# Altium schematic sheet main.schdoc
size 594 x 420 mm; Symbol: Drawing-Symbol_A4; Version: V1.0; Page Size: A4; Project: Bottle; @Update Date: 2026-04-30; @Create Date: 2026-03-28; Device: Drawing-Symbol_A4; @Board Name: main; @Page Name: P1; @Create Time: 23:23:22; @Page Count: 0; @Page No: 0; @Schematic Name: Schematic2; @Update Time: 23:23:22; @Assembly Variant: Basic; Border: 1; Title Block Position: 3; Size: A4; Width: 2338; Height: 1300; Region Start: 1; X Region Count: 6; Y Region Count: 4; Blade Width: 10; Title Block: 1; SheetNumber: 1; SheetTotal: 2
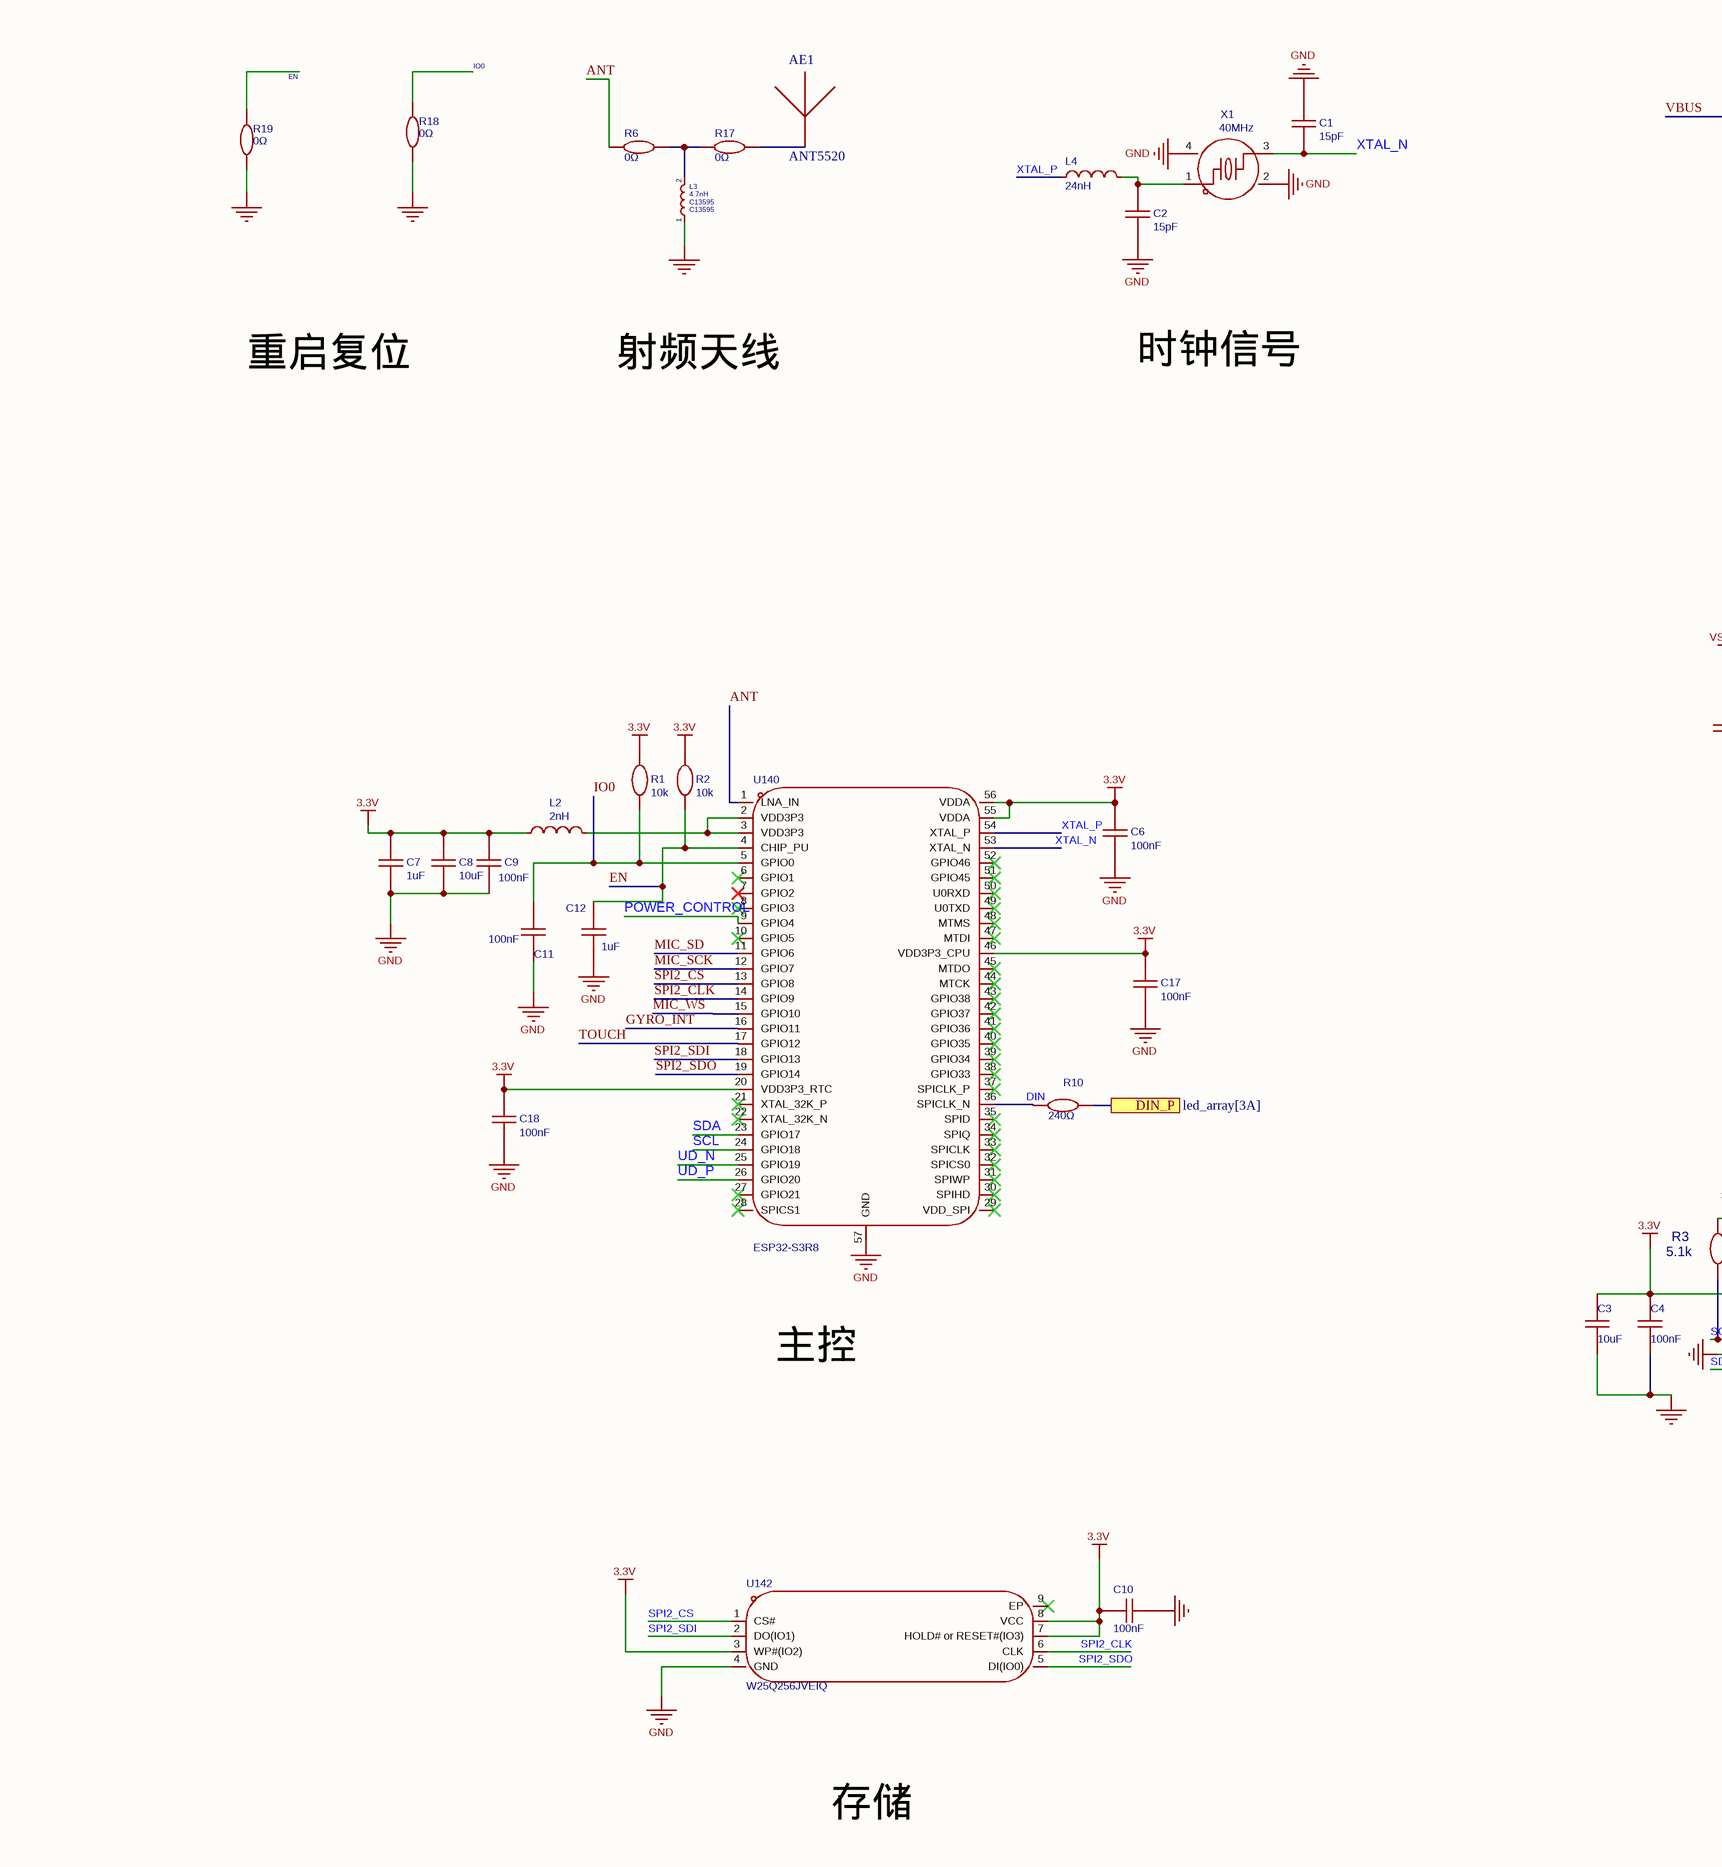
[diagram p0: main.schdoc, left]
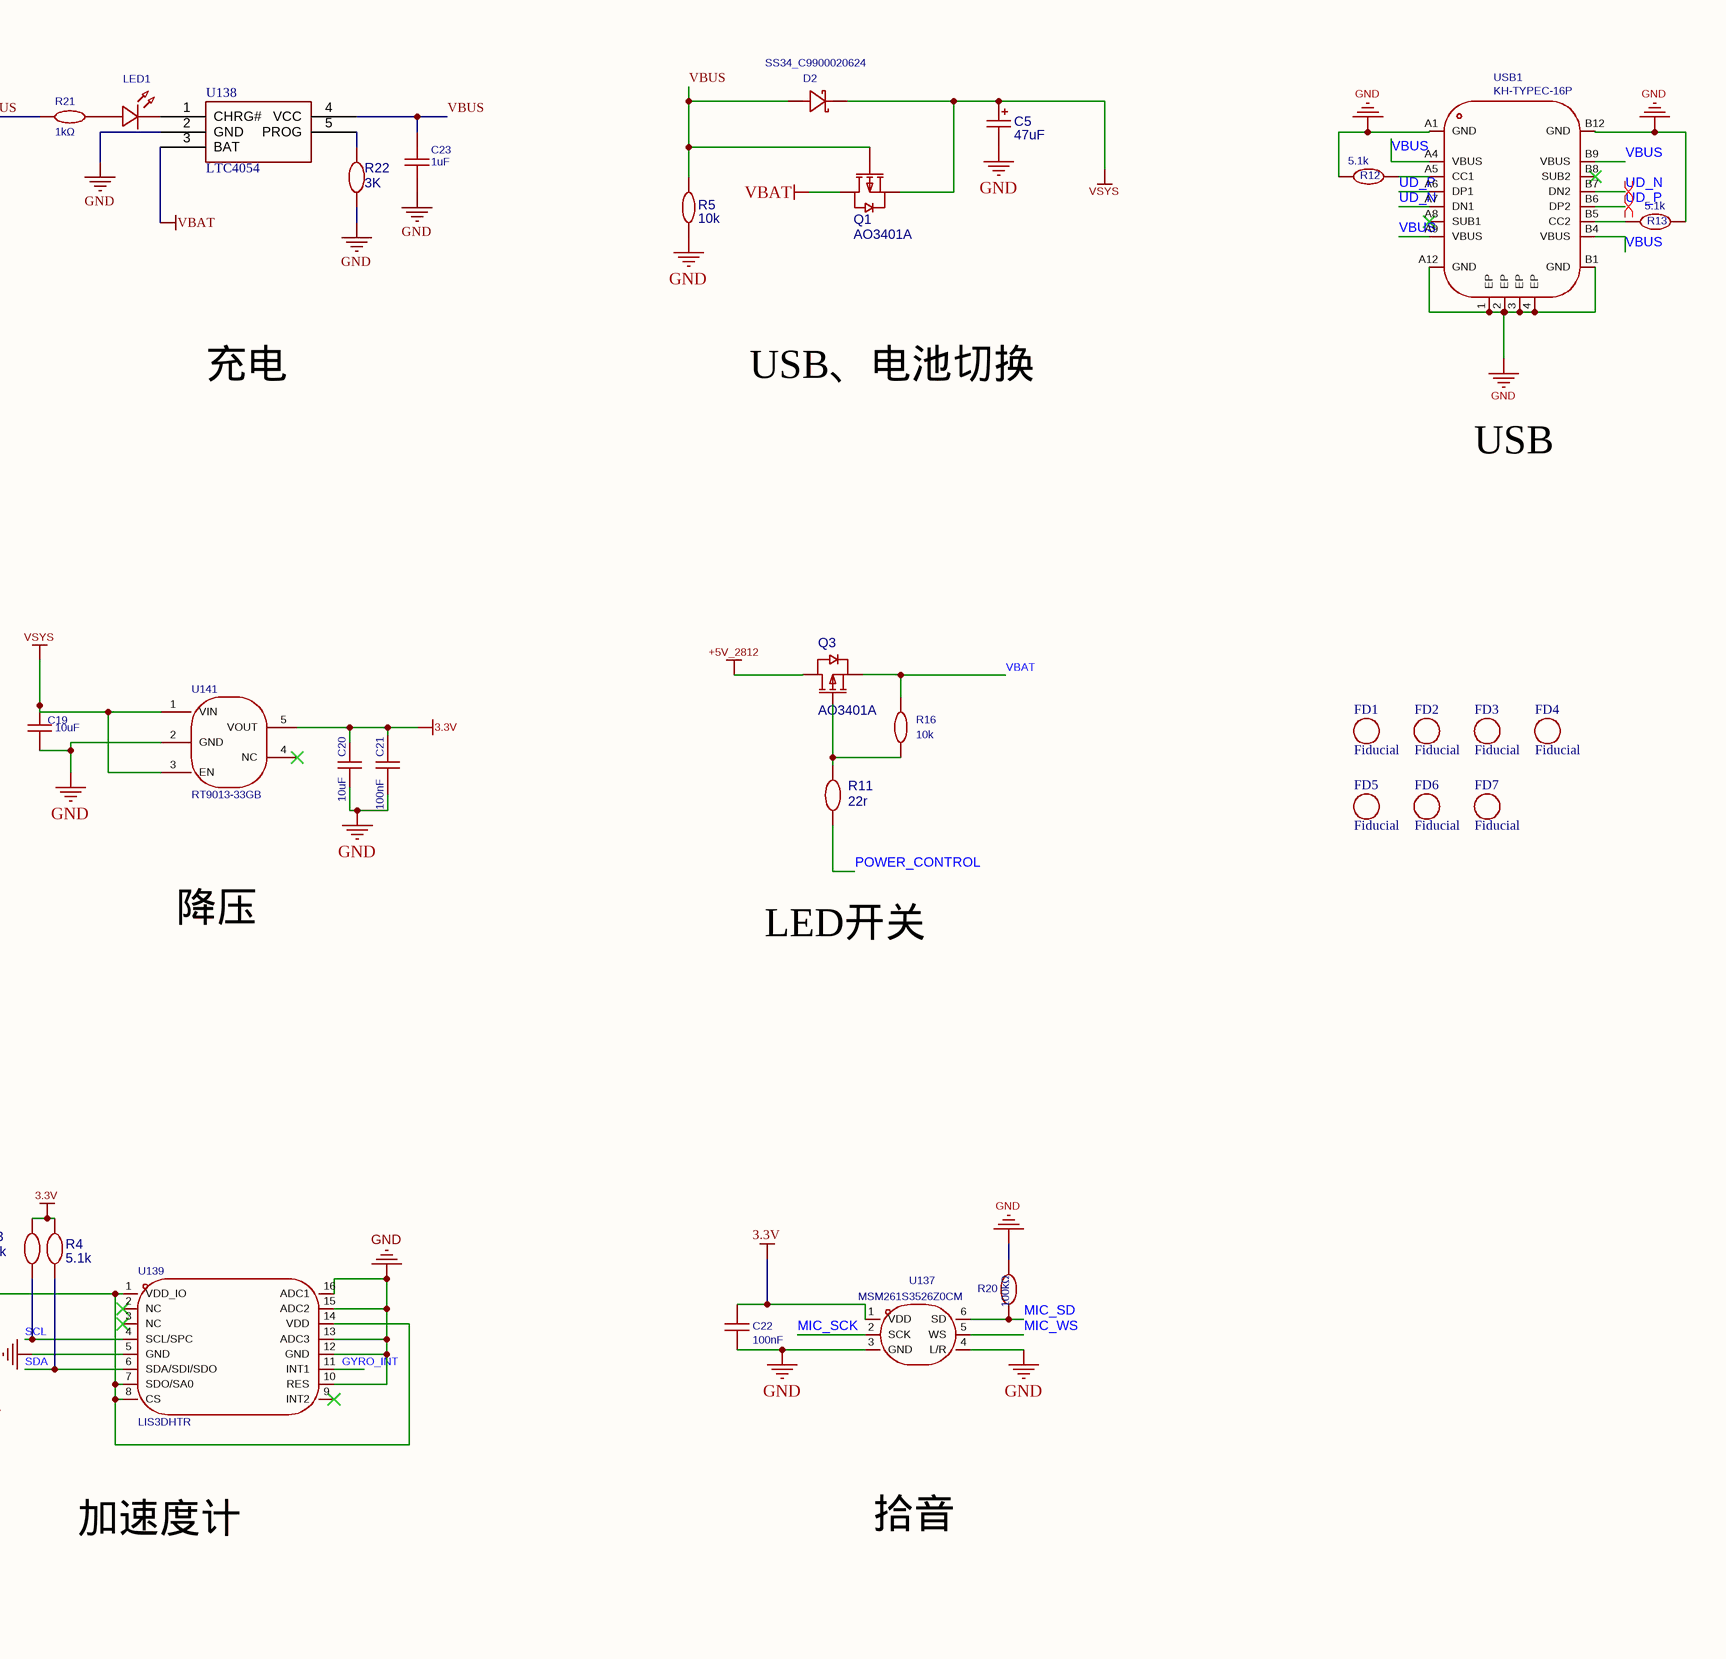
[diagram p1: main.schdoc, right]

## Parts
AE1  ANT5520  [ANT_5520]
C1  15pF  [C0402]
C2  15pF  [C0402]
C3  10uF  [C0402]
C4  100nF  [C0402]
C5  47uF  [C0603]
C6  100nF  [C0402]
C7  1uF  [C0402]
C8  10uF  [C0402]
C9  100nF  [C0402]
C10  100nF  [C0402]
C11  100nF  [C0402]
C12  1uF  [C0402]
C17  100nF  [C0402]
C18  100nF  [C0402]
C19  10uF  [C0402]
C20  10uF  [C0402]
C21  100nF  [C0402]
C22  100nF  [C0402]
C23  1uF  [C0402]
D2  SS34_C9900020624  [SMA_L4.3-W2.6-LS5.1-R-RD]
FD1  Fiducial  [FIDUCIAL_1MM]
FD2  Fiducial  [FIDUCIAL_1MM]
FD3  Fiducial  [FIDUCIAL_1MM]
FD4  Fiducial  [FIDUCIAL_1MM]
FD5  Fiducial  [FIDUCIAL_1MM]
FD6  Fiducial  [FIDUCIAL_1MM]
FD7  Fiducial  [FIDUCIAL_1MM]
L2  2nH  [C0402]
L3  value 4.7nH  MNF PART NUMBER: C13595  [C0402]  (hidden comment: 3nH)
L4  24nH  [C0402]
LED1  LED-0603_G  [C0402]  (value not drawn)
Q1  AO3401A  [SOT-23-3_L2.9-W1.6-P1.90-LS2.8-BR_1]
Q3  AO3401A  [SOT-23-3_L2.9-W1.3-P1.90-LS2.4-BR]
R1  10k  [R0402]
R2  10k  [R0402]
R3  5.1k  [R0402]
R4  5.1k  [R0402]
R5  10k  [R0402]
R6  value 0Ω  [R0402]  (hidden comment: 0r)
R10  value 240Ω  [R0402]  (hidden comment: 240r)
R11  22r  [R0402]
R12  5.1k  [R0402]
R13  5.1k  [R0402]
R16  10k  [R0402]
R17  value 0Ω  [R0402]  (hidden comment: 0r)
R18  value 0Ω  [R0402]  (hidden comment: 0r)
R19  value 0Ω  [R0402]  (hidden comment: 0r)
R20  100kΩ  [R0402]
R21  1kΩ  [R0402]
R22  3K  [R0402]
U137  MSM261S3526Z0CM  [MIC-SMD_6P-L3.5-W2.7-P0.90-TR]
U138  LTC4054  [SOT-23-5_L3.0-W1.7-P0.95-LS2.8-BL]
U139  LIS3DHTR  [LGA-16_L3.0-W3.0-P0.50-TL]
U140  ESP32-S3R8  [QFN-56_L7.0-W7.0-P0.40-TL-EP4.0]
U141  RT9013-33GB  [SOT-23-5_L3.0-W1.7-P0.95-LS2.8-BL]
U142  W25Q256JVEIQ  [WSON-8_L8.0-W6.10-P1.27-BL-EP-MINI]
USB1  KH-TYPEC-16P  [USB-TYPEC-16P-SMD]
X1  40MHz  [CRYSTAL-SMD_4P-L2.5-W2.0-BL]

## Ports
DIN_P (see led_array[3A])

## Nets
3.3V: C3.2 C4.2 C6.2 C7.2 C8.2 C9.2 C10.2 C17.2 C18.2 C20.2 C21.2 C22.2 L2.1 R1.2 R2.2 R3.2 R4.2 U137.1(VDD) U139.1(VDD_IO) U139.7(SDO/SA0) U139.8(CS) U139.14(VDD) U140.20(VDD3P3_RTC) U140.46(VDD3P3_CPU) U140.55(VDDA) U140.56(VDDA) U141.5(VOUT) U142.3(WP#(IO2)) U142.7(HOLD#_or_RESET#(IO3)) U142.8(VCC)
+5V_2812: Q3.3(D)
GND: C1.1 C2.2 C3.1 C4.1 C5.2 C6.1 C7.1 C8.1 C9.1 C10.1 C11.1 C12.1 C17.1 C18.1 C19.1 C20.1 C21.1 C22.1 C23.1 L3.1 R5.1 R12.1 R13.2 R18.1 R19.1 R20.2 R22.1 U137.3(GND) U137.4(L/R) U138.2(GND) U139.5(GND) U139.10(RES) U139.12(GND) U139.13(ADC3) U139.15(ADC2) U139.16(ADC1) U140.57(GND) U141.2(GND) U142.4(GND) USB1.1(EP) USB1.2(EP) USB1.3(EP) USB1.4(EP) USB1.A1(GND) USB1.A12(GND) USB1.B1(GND) USB1.B12(GND) X1.2(GND) X1.4(GND)
VBAT: Q1.3(D) Q3.2(S) R16.1 U138.3(BAT)
VSYS: C5.1 C19.2 D2.2(K) Q1.2(S) U141.1(VIN) U141.3(EN)
ANT: R6.1 U140.1(LNA_IN)
DIN: R10.1 U140.36(SPICLK_N)
DIN_P: R10.2 ; port DIN_P
EN: C12.2 R2.1 R19.2 U140.4(CHIP_PU)
GYRO_INT: U139.11(INT1) U140.16(GPIO11)
IO0: C11.2 R1.1 R18.2 U140.5(GPIO0)
MIC_SCK: U137.2(SCK) U140.12(GPIO7)
MIC_SD: R20.1 U137.6(SD) U140.11(GPIO6)
MIC_WS: U137.5(WS) U140.15(GPIO10)
POWER_CONTROL: R11.2 U140.9(GPIO4)
SCL: R3.1 U139.4(SCL/SPC) U140.24(GPIO18)
SDA: R4.1 U139.6(SDA/SDI/SDO) U140.23(GPIO17)
SPI2_CLK: U140.14(GPIO9) U142.6(CLK)
SPI2_CS: U140.13(GPIO8) U142.1(CS#)
SPI2_SDI: U140.18(GPIO13) U142.2(DO(IO1))
SPI2_SDO: U140.19(GPIO14) U142.5(DI(IO0))
TOUCH: U140.17(GPIO12)
UD_N: U140.25(GPIO19) USB1.A7(DN1) USB1.B7(DN2)
UD_P: U140.26(GPIO20) USB1.A6(DP1) USB1.B6(DP2)
VBUS: C23.2 D2.1(A) Q1.1(G) R5.2 R21.2 U138.4(VCC) USB1.A4(VBUS) USB1.A9(VBUS) USB1.B4(VBUS) USB1.B9(VBUS)
XTAL_N: C1.2 U140.53(XTAL_N) X1.3
XTAL_P: L4.1 U140.54(XTAL_P)
NetAE1_1: AE1.1(ANT) R17.2
NetC2_1: C2.1 L4.2 X1.1
NetL2_2: L2.2 U140.2(VDD3P3) U140.3(VDD3P3)
NetL3_2: L3.2 R6.2 R17.1
NetLED1_1: LED1.1 R21.1
NetLED1_2: LED1.2 U138.1(CHRG#)
NetQ3_1: Q3.1(G) R11.1 R16.2
NetR12_2: R12.2 USB1.A5(CC1)
NetR13_1: R13.1 USB1.B5(CC2)
NetR22_2: R22.2 U138.5(PROG)

Not connected (* = marked no-connect by the designer): AE1 2; U139 2(NC)* 3(NC)* 9(INT2)*; U140 6(GPIO1)* 7(GPIO2)* 8(GPIO3)* 10(GPIO5)* 21(XTAL_32K_P)* 22(XTAL_32K_N)* 27(GPIO21)* 28(SPICS1)* 29(VDD_SPI)* 30(SPIHD)* 31(SPIWP)* 32(SPICS0)* 33(SPICLK)* 34(SPIQ)* 35(SPID)* 37(SPICLK_P)* 38(GPIO33)* 39(GPIO34)* 40(GPIO35)* 41(GPIO36)* 42(GPIO37)* 43(GPIO38)* 44(MTCK)* 45(MTDO)* 47(MTDI)* 48(MTMS)* 49(U0TXD)* 50(U0RXD)* 51(GPIO45)* 52(GPIO46)*; U141 4(NC)*; U142 9(EP)*; USB1 A8(SUB1)* B8(SUB2)*

## Layout directives
differential pair: UD_N, UD_P

## Notes on the sheet
- 重启复位
- 射频天线
- 时钟信号
- 充电
- USB、电池切换
- USB
- 降压
- LED开关
- 主控
- 加速度计
- 拾音
- 存储
- DWG NO:
- REV:
- THIS DOCUMENT AND THE DATA DISCLOSED HEREIN OR
- HEREWITH IS THE PROPERTY OF ALTIUM LIMITED AND MAY
- BE FREELY DISTRIBUTED IN WHOLE. NO RIGHTS ARE
- RESERVED OR EXPRESS OR IMPLIED WARANTEE GIVEN.
- REVISION
- DESCRIPTION
- DATE
- APPROVED
- ENG:
- APPROVALS
- PROJECT
- DSN:
- CHK:
- REFERENCE DOCUMENTS
- PROJECT REVISION:
- TITLE
- DOCUMENT REVISION:
- DESIGN ITEM:
- BOM:
- FAB DWG:
- PCB DWG:
- ASSY DWG:
- SCALE:
- A2
- SIZE
- CAGE CODE
- FILE NAME
- DWG NO.
- SHEET
- OF
- REV

## Library data of the parts
AE1 = ANT_5520
C1 C2 = 10PF: Add into BOM: yes; ModelId: fca5be93b99f4b5a9a2fd372d58c31d9; ModelName: C0603; Symbol: 10PF; Device: 10PF; Convert to PCB: yes; FootprintName: C0603
  C1: Origin Footprint: C0603
C3 C4 C10 = CGA0603X7R104K500JT: 容值:100nF;精度:±10%;额定电压:50V;材质(温度系数):X7R;; Manufacturer: HRE(芯声); AddInBom: yes; ModelId: ac125912035d415993ca9572d50418b1; ModelName: C0603_L1.6-W0.8-H0.8; ModelTransform: 62.992,31.496,0,0,0,0,0,0,0; Tolerance: ±10%; Voltage Rated: 50V; Temperature Coefficient: X7R; Symbol: CGA0603X7R104K500JT; Device: CGA0603X7R104K500JT; LCSC Part Name: 100nF ±10% 50V; ManufacturerPart: CGA0603X7R104K500JT; Supplier Footprint: 0603; Supplier: LCSC; ConvertToPcb: yes; FootprintName: C0603
  C3: Value: 10uF
  C4 C10: SupplierPart: C6119867; Value: 100nF
C5 = CA45-B-10V-47uF-K: 容值:47uF;精度:±10%;额定电压:10V;等效串联电阻:2.4Ω@100kHz;; Manufacturer: CEC(振华新云); Add into BOM: yes; Origin Footprint: CAP-SMD_L3.5-W2.8-R-RD; 3D Model: b77bd53aeda446d2bdd09b0fdaf9418a; 3D Model Transform: 145.669,110.236,0,0,0,0,0,0,0; Tolerance: ±10%; Rated Voltage: 10V; ModelName: CASE-B_L3.5-W2.8-H1.9; Symbol: 47uF; Device: CA45-B-10V-47uF-K; Convert to PCB: yes; LCSC Part Name: 47uF ±10% 10V; Supplier Part: C136658; Manufacturer Part: CA45-B-10V-47uF-K; Supplier Footprint: CASE-B-3528; JLCPCB Part Class: Extended Part; Datasheet: https://atta.szlcsc.com/upload/public/pdf/source/20171123/C136658_15114108124621137439.pdf; Supplier: LCSC; Value: 47uF; Equivalent Series Resistance(ESR): 2.4Ω@100kHz; Operating Temperature: -55℃~+125℃; FootprintName: CASE-B_3528
C6 C9 C17 C18 = 100NF: Add into BOM: yes; Origin Footprint: C0603; ModelId: fca5be93b99f4b5a9a2fd372d58c31d9; Symbol: 100NF; Device: 100NF; Convert to PCB: yes; FootprintName: C0603; ModelName: C0603
C7 C11 C12 = 1UF: Add into BOM: yes; Origin Footprint: C0603; ModelId: fca5be93b99f4b5a9a2fd372d58c31d9; Symbol: 1UF; Device: 1UF; Convert to PCB: yes; FootprintName: C0603; ModelName: C0603
C8 = 10UF: Add into BOM: yes; Origin Footprint: C0603; ModelId: fca5be93b99f4b5a9a2fd372d58c31d9; Symbol: 10UF; Device: 10UF; Convert to PCB: yes; FootprintName: C0603; ModelName: C0603
C19 C20 = CL21A106KAYNNNE_C15850: 容值:10uF;精度:±10%;额定电压:25V;材质(温度系数):X5R;; Manufacturer: SAMSUNG(三星); 3D Model: 1ba041120af144c991958decab20d241; 3D Model Transform: 78.74,51.181,0,0,0,0,0,0.0005,0; Tolerance: ±10%; Voltage Rated: 25V; Temperature Coefficient: X5R; AddInBom: yes; ModelName: C0805_L2.0-W1.3-H1.3; Symbol: CL21A106KAYNNNE; Device: CL21A106KAYNNNE_C15850; LCSC Part Name: 10uF ±10% 25V; Manufacturer Part: CL21A106KAYNNNE; Supplier Footprint: 0805; JLCPCB Part Class: 基础库; Datasheet: https://atta.szlcsc.com/upload/public/pdf/source/20160103/1457707679302.pdf; Supplier: LCSC; Value: 10UF; ConvertToPcb: yes; FootprintName: C0805
C21 = CC0603KRX7R9BB104: 容值:100nF;精度:±10%;额定电压:50V;材质(温度系数):X7R;; Manufacturer: YAGEO(国巨); 3D Model: ac125912035d415993ca9572d50418b1; 3D Model Transform: 62.992,31.496,0,0,0,0,0,0,0; Tolerance: ±10%; Voltage Rated: 50V; Temperature Coefficient: X7R; AddInBom: yes; ModelName: C0603_L1.6-W0.8-H0.8; Symbol: CC0603KRX7R9BB104; Device: CC0603KRX7R9BB104; LCSC Part Name: 100nF ±10% 50V; Manufacturer Part: CC0603KRX7R9BB104; Supplier Footprint: 0603; JLCPCB Part Class: 基础库; Datasheet: https://atta.szlcsc.com/upload/public/pdf/source/20180910/C282072_33301C7F631E79921B82A8DAC6BCC5B3.pdf; Supplier: LCSC; Value: 100NF; ConvertToPcb: yes; FootprintName: C0603
C22 = CL05B104KO5NNNC: 容值:100nF;精度:±10%;额定电压:16V;温度系数:X7R;; Manufacturer: SAMSUNG(三星); Symbol: 0.1uF; Add into BOM: yes; Voltage Rating: 16V; 3D Model: 36a51122f27c49738f86b3bfa98863e0; 3D Model Transform: 39.37,19.685,0,0,0,0,0,0,0; Tolerance: ±10%; Temperature Coefficient: X7R; ModelName: C0402_L1.0-W0.5-H0.5; Device: CL05B104KO5NNNC; Convert to PCB: yes; Supplier: LCSC; Manufacturer Part: CL05B104KO5NNNC; Supplier Part: C1525; JLCPCB Part Class: Basic Part; Datasheet: https://atta.szlcsc.com/upload/public/pdf/source/20160218/1457707763339.pdf; LCSC Part Name: 100nF ±10% 16V; Supplier Footprint: 0402; Value: 100nF; Voltage Rated: 16V; FootprintName: C0402_1
C23 = 1uF: Add into BOM: yes; Origin Footprint: C0603; ModelId: fca5be93b99f4b5a9a2fd372d58c31d9; Symbol: 1UF; Device: 1UF; Convert to PCB: yes; FootprintName: C0603; ModelName: C0603
D2 = SS34_C9900020624: Manufacturer: null; Add into BOM: yes; ModelId: 6890bb9641474820a71fce2135ca3aaa; Symbol: SS34_C9900020624; Device: SS34_C9900020624; Convert to PCB: yes; Origin Footprint: SMA_L4.3-W2.6-LS5.1-R-RD; Supplier: LCSC; Supplier Part: C9900020624; JLCPCB Part Class: Extended Part; FootprintName: SMA_L4.3-W2.6-LS5.1-R-RD; ModelName: SMA_L4.3-W2.6-LS5.1-R-RD
L2 = 2nH: Add into BOM: yes; Origin Footprint: L0603; Symbol: 2nH; Device: 2nH; Convert to PCB: yes; FootprintName: L0603
L3 = Device_L: Inductor; ki_keywords: inductor choke coil reactor magnetic; ki_fp_filters: Choke_* *Coil* Inductor_* L_*; UniqueId: 01f5988480b85854; Attribute1: L6; AddInBom: yes; Device: Device_L; Symbol: Device_L; UserDocLink: ~; LCSC: C13595; FootprintName: Inductor_SMD:L_0402_1005Metric
L4 = 24nH: Add into BOM: yes; Origin Footprint: L0603; Symbol: 24nH; Device: 24nH; Convert to PCB: yes; FootprintName: L0603
LED1 = LED-0603_G: Manufacturer: EVERLIGHT(台湾亿光); Manufacturer Part: 19-217/GHC-YR1S2/3T; Add into BOM: yes; Origin Footprint: LED0603_GREEN; ModelId: 8b5fcaf0229049f8a37a9c352bb0ca0a; Symbol: LED-0603_G; Device: LED-0603_G; Convert to PCB: yes; Supplier Part: C72043; Supplier: LCSC; FootprintName: LED0603_GREEN; ModelName: LED-0603_G
Q1 = CJ3401_1: 类型:P沟道;漏源电压(Vdss):30V;连续漏极电流(Id):4.2A;功率(Pd):350mW;导通电阻(RDS(on)@Vgs,Id):65mΩ@10V,4.2A;; Manufacturer: CJ(江苏长电/长晶); Symbol: CJ3401; Add into BOM: yes; Origin Footprint: SOT-23-3_L2.9-W1.6-P1.90-LS2.8-BR; 3D Model: 89cb27a44ab2466697082bb9fd73a7d0; 3D Model Transform: 110.236,114.173,0,180,0,0,-0.005,0.0005,0; Type: P沟道; Drain Source Voltage (Vdss): 30V; Power Dissipation (Pd): 350mW; Gate Threshold Voltage (Vgs(th)@Id): 1.3V@250uA; ModelName: SOT-23-3L_L2.9-W1.6-H1.1-LS2.8-P0.95; Device: CJ3401_1; Convert to PCB: yes; LCSC Part Name: P沟道 30V 4.2A; Supplier Part: C13799; Manufacturer Part: CJ3401; Supplier Footprint: SOT-23; JLCPCB Part Class: Extended Part; Datasheet: https://atta.szlcsc.com/upload/public/pdf/source/20140815/1457707217656.pdf; Supplier: LCSC; Continuous Drain Current (Id): 4.2A; Drain Source On Resistance (RDS(on)@Vgs,Id): 65mΩ@10V,4.2A; FootprintName: SOT-23-3_L2.9-W1.6-P1.90-LS2.8-BR_1
Q3 = SI2301CDS: Manufacturer: TECH PUBLIC(台舟); Add into BOM: yes; 3D Model: d777607a152f4f3aac9bb0d0c14ed6fd; 3D Model Transform: v2:[-39.37007874015748,4.821444091131312e-15,0,-4.821444091131312e-15,-39.37007874015748,0,0,0,39.37007874015748,0.001,-0.001,0]; ModelName: SOT-23-3P_L2.9-W1.3-H1.0-LS2.4-P0.95; Symbol: SI2301CDS; Device: SI2301CDS; Convert to PCB: yes; Supplier: LCSC; Supplier Part: C2841446; Manufacturer Part: SI2301CDS; JLCPCB Part Class: Extended Part; FootprintName: SOT-23-3_L2.9-W1.3-P1.90-LS2.4-BR
R1 R2 = 10k: Add into BOM: yes; Origin Footprint: R0603; ModelId: fc143cca1e79419f9cd78b61e9279f08; Symbol: 10k; Device: 10k; Convert to PCB: yes; FootprintName: R0603; ModelName: R0603
R3 R4 R22 = 4.7K: Add into BOM: yes; 3D Model: 6bd5cd867e9542ebae21caaf5d2d4c4d; 3D Model Transform: v2:[2.410722045565656e-15,39.37007874015748,0,-39.37007874015748,2.410722045565656e-15,0,0,0,39.37007874015748,0,0,0]; ModelName: R0603; Symbol: 4.7K; Device: 4.7K; Convert to PCB: yes; FootprintName: R0603
R5 = AC0805FR-0710KL: 电阻类型:厚膜电阻;阻值:10kΩ;精度:±1%;功率:125mW;; Manufacturer: YAGEO(国巨); Symbol: 10K_1; Add into BOM: yes; Origin Footprint: R0805; Resistance: 10kΩ; 3D Model: 37a81e68749a4138bd2dfa6897b24b85; 3D Model Transform: 78.74,51.181,0,0,0,0,0,-0.0005,0; Value: 10kΩ; Tolerance: ±1%; Power(Watts): 125mW; Temperature Coefficient: ±100ppm/℃; Overload Voltage (Max): 150V; ModelName: R0805_L2.0-W1.3-H0.6; Device: AC0805FR-0710KL; Convert to PCB: yes; LCSC Part Name: 10kΩ ±1% 125mW; Supplier Part: C140868; Manufacturer Part: AC0805FR-0710KL; Supplier Footprint: 0805; JLCPCB Part Class: Extended Part; Datasheet: https://atta.szlcsc.com/upload/public/pdf/source/20171113/C140868_15105613027091115785.pdf; Supplier: LCSC; Type: 厚膜电阻; Operating Temperature Range: -55℃~+155℃; FootprintName: R0603
R6 R17-R19 = 0402WGF0000TCE: 阻值:0Ω;精度:±1%;功率:62.5mW;温度系数:±800ppm/℃;电阻类型:厚膜电阻;; Manufacturer: UNI-ROYAL(厚声); AddInBom: yes; ModelId: 671aefced39d4c318694bba8bd8efd39; ModelName: R0402_L1.0-W0.5-H0.5; ModelTransform: 39.37,19.685,0,0,0,0,0,0.0005,0; Tolerance: ±1%; Power(Watts): 62.5mW; Overload Voltage (Max): 50V; JLCPCB Part Class: Basic Part; Symbol: 0402WGF0000TCE; Device: 0402WGF0000TCE; Supplier: LCSC; Manufacturer Part: 0402WGF0000TCE; Supplier Part: C17168; LCSC Part Name: 0Ω ±1% 62.5mW 厚膜电阻; Supplier Footprint: 0402; Datasheet: https://atta.szlcsc.com/upload/public/pdf/source/20200306/C422600_1E6D84923E4A46A82E41ADD87F860B5C.pdf; ConvertToPcb: yes; FootprintName: R0402; Temperature Coefficient: ±800ppm/℃; Type: 厚膜电阻; Operating Temperature Range: -55℃~+155℃
R10 = 0402WGF2400TCE: 阻值:240Ω;精度:±1%;功率:62.5mW;温度系数:±100ppm/℃;电阻类型:厚膜电阻;; Manufacturer: UNI-ROYAL(厚声); AddInBom: yes; ModelId: 671aefced39d4c318694bba8bd8efd39; ModelName: R0402_L1.0-W0.5-H0.5; ModelTransform: 39.37,19.685,0,0,0,0,0,0.0005,0; Tolerance: ±1%; Power(Watts): 62.5mW; Overload Voltage (Max): 50V; JLCPCB Part Class: Extended Part; Symbol: 0402WGF2400TCE; Device: 0402WGF2400TCE; Supplier: LCSC; Manufacturer Part: 0402WGF2400TCE; Supplier Part: C25094; LCSC Part Name: 240Ω ±1% 62.5mW 厚膜电阻; Supplier Footprint: 0402; Datasheet: https://atta.szlcsc.com/upload/public/pdf/source/20200306/C422600_1E6D84923E4A46A82E41ADD87F860B5C.pdf; ConvertToPcb: yes; FootprintName: R0402; Temperature Coefficient: ±100ppm/℃; Type: 厚膜电阻; Operating Temperature Range: -55℃~+155℃
R11 = 22r: Add into BOM: yes; 3D Model: 6bd5cd867e9542ebae21caaf5d2d4c4d; 3D Model Transform: v2:[2.410722045565656e-15,39.37007874015748,0,-39.37007874015748,2.410722045565656e-15,0,0,0,39.37007874015748,0,0,0]; ModelName: R0603; Symbol: 22r; Device: 22r; Convert to PCB: yes; FootprintName: R0603
R12 R13 = 5.1k: Add into BOM: yes; Origin Footprint: R0603; ModelId: fc143cca1e79419f9cd78b61e9279f08; Symbol: 5.1k; Device: 5.1k; Convert to PCB: yes; FootprintName: R0603; ModelName: R0603
R16 = 0603WAF1002T5E: 电阻类型:厚膜电阻;阻值:10kΩ;精度:±1%;功率:100mW;工作电压:75V;温度系数:±100ppm/℃;; Manufacturer: UNI-ROYAL(厚声); Add into BOM: yes; 3D Model: fc143cca1e79419f9cd78b61e9279f08; 3D Model Transform: 31.8897,63.7794,0,90,0,0,0,0,0; Value: 10kΩ; Tolerance: ±1%; Power(Watts): 100mW; Voltage-Supply(Max): 75V; ModelName: R0603; Symbol: 0603WAF1002T5E; Device: 0603WAF1002T5E; Convert to PCB: yes; Supplier Part: C25804; Supplier: LCSC; Manufacturer Part: 0603WAF1002T5E; LCSC Part Name: 厚膜电阻 10kΩ ±1% 100mW; Supplier Footprint: 0603; JLCPCB Part Class: Basic Part; Datasheet: https://item.szlcsc.com/datasheet/0603WAF1002T5E/26547.html; Type: 厚膜电阻; Temperature Coefficient: ±100ppm/℃; Operating Temperature: -55℃~+155℃; FootprintName: R0603
R20 = 0402WGF1003TCE: 电阻类型:厚膜电阻;阻值:100kΩ;精度:±1%;功率:62.5mW;工作电压:50V;温度系数:±100ppm/℃;; Manufacturer: UNI-ROYAL(厚声); Symbol: 100k; Add into BOM: yes; 3D Model: 671aefced39d4c318694bba8bd8efd39; 3D Model Transform: 39.37,19.685,0,0,0,0,0,0.0005,0; Voltage-Supply(Max): 50V; Tolerance: ±1%; Power(Watts): 62.5mW; ModelName: R0402_L1.0-W0.5-H0.5; Device: 0402WGF1003TCE; Convert to PCB: yes; Supplier Part: C25741; Supplier: LCSC; Manufacturer Part: 0402WGF1003TCE; LCSC Part Name: 100kΩ ±1% 62.5mW; JLCPCB Part Class: 基础库; Datasheet: https://atta.szlcsc.com/upload/public/pdf/source/20200306/C422600_1E6D84923E4A46A82E41ADD87F860B5C.pdf; Operating Temperature: -55℃~+155℃; Supplier Footprint: 0402; Type: 厚膜电阻; Value: 100kΩ; Temperature Coefficient: ±100ppm/℃; Overload Voltage (Max): 50V; Operating Temperature Range: -55℃~+155℃; FootprintName: R0402_1
R21 = 0603WAF1001T5E: 电阻类型:厚膜电阻;阻值:1kΩ;精度:±1%;功率:100mW;工作电压:75V;温度系数:±100ppm/℃;; Manufacturer: UNI-ROYAL(厚声); Add into BOM: yes; 3D Model: fc143cca1e79419f9cd78b61e9279f08; 3D Model Transform: 31.8897,63.7794,0,90,0,0,0,0,0; Tolerance: ±1%; Power(Watts): 100mW; Voltage-Supply(Max): 75V; ModelName: R0603; Symbol: 0603WAF1001T5E; Device: 0603WAF1001T5E; Convert to PCB: yes; Supplier Part: C21190; Supplier: LCSC; Manufacturer Part: 0603WAF1001T5E; LCSC Part Name: 1kΩ ±1% 100mW 厚膜电阻; Supplier Footprint: 0603; JLCPCB Part Class: Basic Part; Datasheet: https://item.szlcsc.com/datasheet/0603WAF1001T5E/21904.html; Type: 厚膜电阻; Value: 1kΩ; Temperature Coefficient: ±100ppm/℃; Operating Temperature: -55℃~+155℃; FootprintName: R0603
U137 = MSM261S3526Z0CM: 方向:全指向;信噪比:64dB;灵敏度:-26dB;阻抗:-;; Manufacturer: MEMS(敏芯微); Symbol: MSM261S3526Z0CM_1; Add into BOM: yes; 3D Model: 76b3790cc1704d2883f926567aae47b1; 3D Model Transform: 106.299,137.795,0,0,0,0,0,0,0; Direction: 全指向; Supply Voltage: 1.8V; Current Consumption: 750uA; SNR(Signal to Noise Ratio): 64dB; Sensitivity: -26dB; Device: MSM261S3526Z0CM; Convert to PCB: yes; Supplier: LCSC; Supplier Part: C966933; Manufacturer Part: MSM261S3526Z0CM; JLCPCB Part Class: Extended Part; LCSC Part Name: MSM261S3526Z0CM; Supplier Footprint: LGA-6(2.7x3.5); Datasheet: https://atta.szlcsc.com/upload/public/pdf/source/20210104/C966933_3269232C81BB891E12095FC7E88FC637.pdf; Impedance: -; FootprintName: MIC-SMD_6P-L3.5-W2.7-P0.90-TR; ModelName: MIC-SMD_6P-L3.5-W2.7-P0.90-TR
U139 = LIS3DHTR: 轴向:X,Y,Z;; Manufacturer: ST(意法半导体); Symbol: LIS3DHTR_C15134; AddInBom: yes; ModelId: 9ae441d1842848bda5fda48efd45bd94; ModelTransform: 118.11,118.11,0,0,0,0,0,0,0; Axial Direction: X,Y,Z; Supply Voltage: 1.71V~3.6V; Device: LIS3DHTR; LCSC Part Name: LIS3DHTR; SupplierPart: C15134; ManufacturerPart: LIS3DHTR; Supplier Footprint: LGA-16(3x3); JLCPCB Part Class: 扩展库; Datasheet: https://atta.szlcsc.com/upload/public/pdf/source/20170502/1493709336456.pdf; Supplier: LCSC; ConvertToPcb: yes; FootprintName: LGA-16_L3.0-W3.0-P0.50-TL; ModelName: LGA-16_L3.0-W3.0-P0.50-TL; Operating Temperature: -40℃~+85℃
U140 = ESP32-S3R8: 频率范围:2.412GHz~2.484GHz;接口类型:I2C；I2S；UART；USB；SPI;应用领域:蓝牙；IoT；WiFi;数据速率:150Mbps;灵敏度:-74.2dBm;典型应用频率:2.4GHz;; Manufacturer: ESPRESSIF(乐鑫); Symbol: ESP32-S3(R8); Add into BOM: yes; 3D Model: 105b388c0c03439aa7dbf35dd2b762a6; 3D Model Transform: 275.59,275.59,0,0,0,0,0,0,0; Voltage - Supply: 3V~3.6V; Output Power: 18.5dBm; Current Of Transmitting: 283mA; Receive Current: 88mA; Typical Application Frequency: 2.4GHz; Device: ESP32-S3R8; Convert to PCB: yes; Supplier: LCSC; Supplier Part: C2913194; Manufacturer Part: ESP32-S3R8; JLCPCB Part Class: Extended Part; LCSC Part Name: 2.4GHz Wi-Fi + 低功耗蓝牙系统级芯片（SoC）; Supplier Footprint: QFN-56(7x7); Datasheet: https://item.szlcsc.com/datasheet/ESP32-S3R8/3198292.html; Frequency Range: 2.412GHz~2.484GHz; Interface: I2C；I2S；UART；USB；SPI; Applications: 蓝牙；IoT；WiFi; Data Rate: 150Mbps; Sensitivity: -74.2dBm; Operating Temperature: -40℃~+65℃; Type: 收发器; FootprintName: QFN-56_L7.0-W7.0-P0.40-TL-EP4.0; ModelName: QFN-56_L7.0-W7.0-P0.40-TL-EP4.0
U141 = RT9013-33GB: 输出类型:固定;输出极性:正;最大输入电压:5.5V;输出电压:3.3V;输出电流:500mA;电源纹波抑制比(PSRR):50dB@(10kHz);; Manufacturer: RICHTEK(立锜); 3D Model: 0a2a1b8f50944f73965918ad6e5fe167; 3D Model Transform: 118.60433,114.173,0,90,0,0,0.0005,0.0005,0; Output Type: 固定; Output Polarity: 正; Number of Outputs: 1; Maximum Input Voltage: 5.5V; Output Voltage: 3.3V; Dropout Voltage: 400mV@(500mA); Quiescent Current (Ground Current): 50uA; Output Current: 500mA; AddInBom: yes; ModelName: SOT-23-5_L2.9-W1.6-H1.1-LS2.8-P0.95; Symbol: RT9013-33GB; Device: RT9013-33GB; LCSC Part Name: 输入5.5V 输出3.3V 500mA; Supplier Footprint: SOT-23-5; Datasheet: https://atta.szlcsc.com/upload/public/pdf/source/20150504/1457707282459.pdf; Power Supply Rejection Ratio (PSRR): 50dB@(10kHz); Noise: -; Feature: -; Operating Temperature: -40℃~+85℃; Supplier: LCSC; Manufacturer Part: RT9013-33GB; Supplier Part: C47773; JLCPCB Part Class: 扩展库; ConvertToPcb: yes; FootprintName: SOT-23-5_L3.0-W1.7-P0.95-LS2.8-BL
U142 = W25Q256JVEIQ_MINI: 接口类型:SPI;存储容量:256Mbit;时钟频率(fc):133MHz;; Manufacturer: Winbond(华邦); Symbol: W25Q256JVEIQTR; Device: W25Q256JVEIQ_C97522; AddInBom: yes; ModelId: 43ef51fbc8554229856bf47998ce0c31聨0819f05c4eef4c71ace90d822a990e87; ModelName: WSON-8_L8.0-W6.0-H0.78-P1.27; ModelTransform: 315.7474,236.22,0,90,0,0,0,0,0; Interface: SPI; Clock Frequency: 133MHz; Voltage - Supply: 2.7V~3.6V; Program / Erase Cycles: 100000次; Page Programming Time (Tpp): 700us; Block Erase Time(tBE): 120ms@(32KB); Data Retention - TDR (Year): 20年; LCSC Part Name: 具备双/四SPI接口的3V、256Mbit 串行闪存; SupplierPart: C97522; ManufacturerPart: W25Q256JVEIQ; Supplier Footprint: WSON-8-EP(6x8); JLCPCB Part Class: Extended Part; Datasheet: https://item.szlcsc.com/datasheet/W25Q256JVEIQ/98730.html; Supplier: LCSC; ConvertToPcb: yes; FootprintName: WSON-8_L8.0-W6.10-P1.27-BL-EP; Memory Size: 256Mbit; Operating Temperature: -40℃~+85℃
USB1 = KH-TYPEC-16P: Add into BOM: yes; 是否验证: 是; Symbol: KH-TYPEC-16P; Device: KH-TYPEC-16P; Convert to PCB: yes; Origin Footprint: USB-TYPEC-16P-SMD; FootprintName: USB-TYPEC-16P
X1 = 40MHz: Manufacturer: JGHC(晶光华); Add into BOM: yes; ModelId: d23e0abc26e54c15b6292fd5f43702fa; Symbol: 40MHz; Device: 40MHz; Convert to PCB: yes; Origin Footprint: CRYSTAL-SMD_4P-L2.5-W2.0-BL; Supplier: LCSC; Supplier Part: C555614; JLCPCB Part Class: Extended Part; FootprintName: CRYSTAL-SMD_4P-L2.5-W2.0-BL; ModelName: CRYSTAL-SMD_4P-L2.5-W2.0-BL